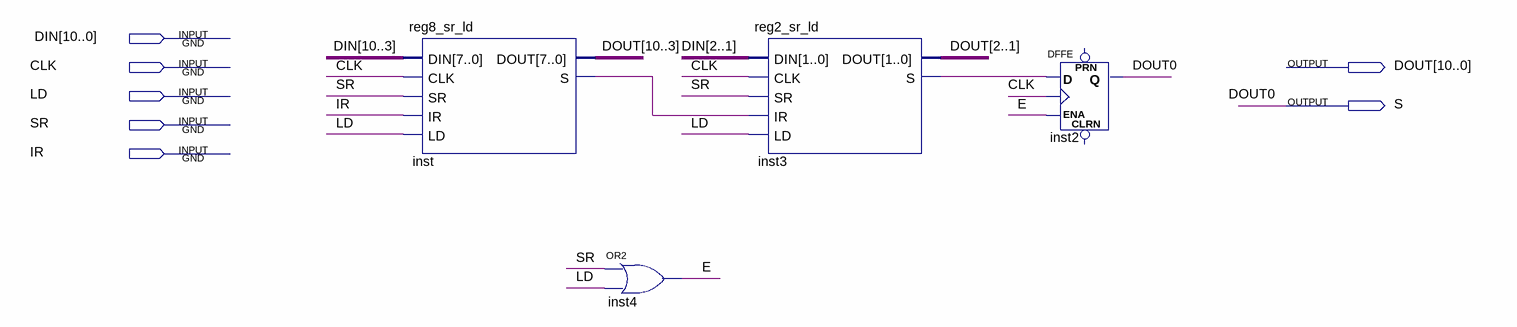
[diagram p0: schematic sheet]
// Quartus schematic reg11_sr_ld.bdf as structural Verilog: 4 symbols, 7 pins
module reg11_sr_ld (
  input  [10:0] DIN,
  input  CLK,
  input  LD,
  input  SR,
  input  IR,
  output [10:0] DOUT,
  output S
);

  wire E, inst3_s, inst_s;

  reg8_sr_ld inst (.DIN(DIN[10:3]), .CLK(CLK), .SR(SR), .IR(IR), .LD(LD), .DOUT(DOUT[10:3]), .S(inst_s));
  or inst4 (E, SR, LD);
  reg2_sr_ld inst3 (.DIN(DIN[2:1]), .CLK(CLK), .SR(SR), .IR(inst_s), .LD(LD), .DOUT(DOUT[2:1]), .S(inst3_s));
  DFFE inst2 (.D(inst3_s), .CLK(CLK), .ENA(E), .Q(DOUT[0]));  // open: PRN, CLRN

  assign S = DOUT[0];
endmodule
